# Altium schematic sheet ZTK7628P_convert_board_v1.0.SchDoc
size A4
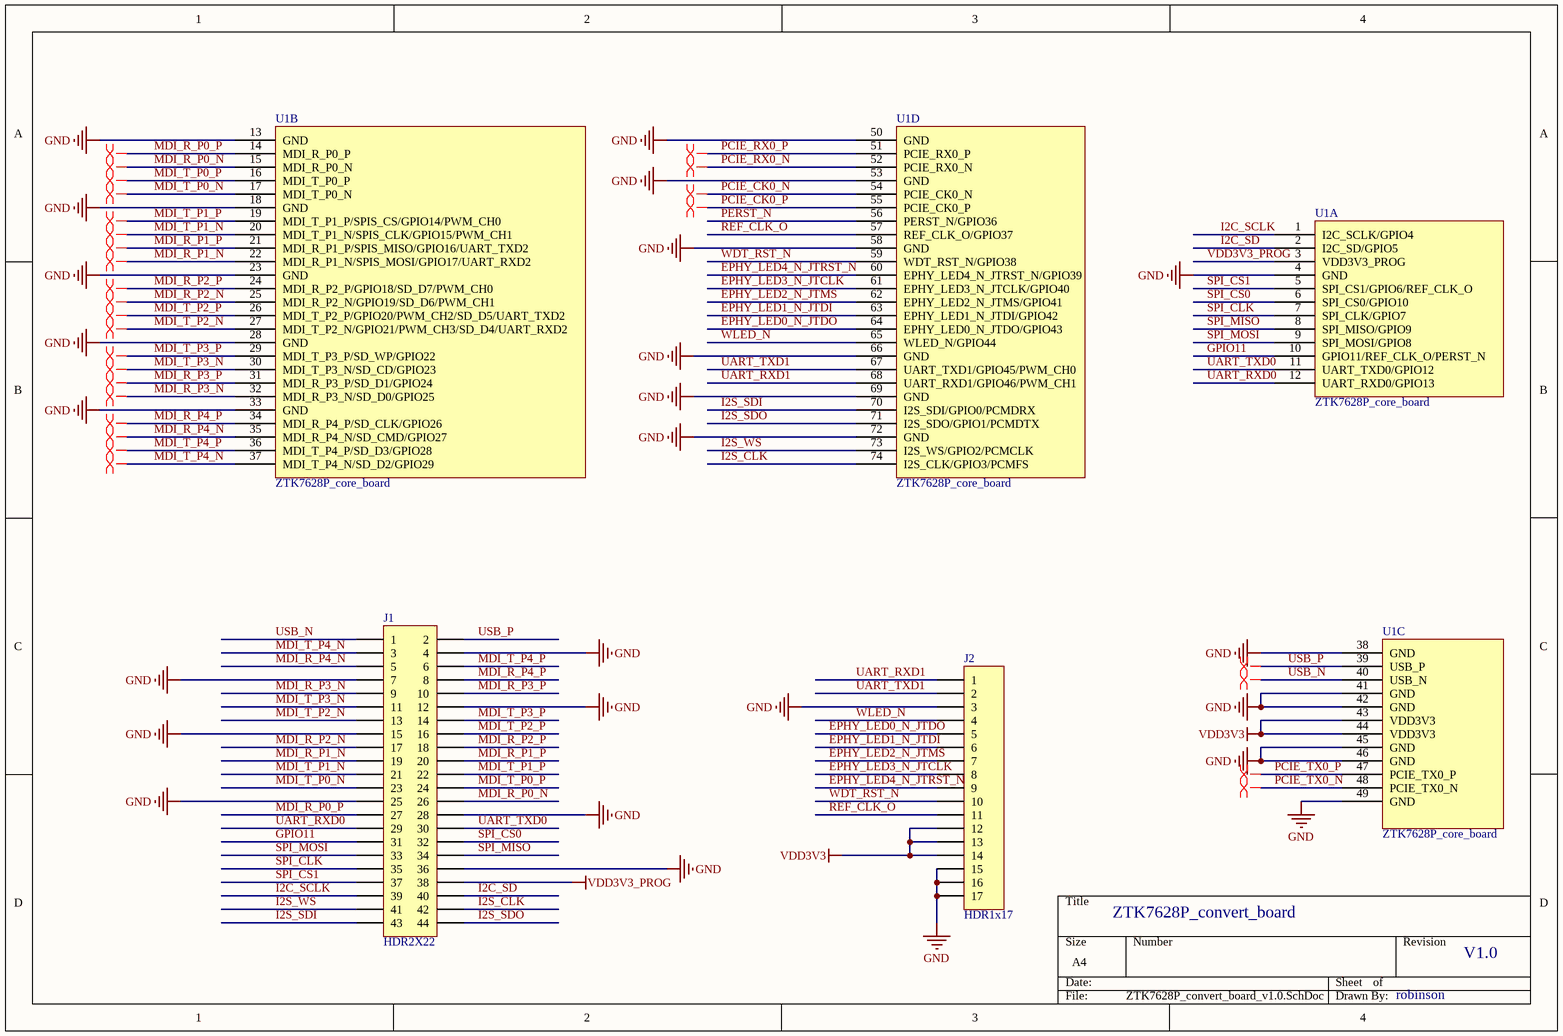
[diagram p0: ZTK7628P_convert_board_v1.0.SchDoc]

## Parts
J1  HDR2X22  [HDR2x22-P-2.0mm]
J2  HDR1x17  [HDR1x17-P-2.0mm]
U1  ZTK7628P_core_board  [ZTK7628P_core_board]  (parts A,B,C,D of 4)

## Nets
GND: J1.4 J1.7 J1.12 J1.15 J1.25 J1.28 J1.36 J2.3 J2.15 J2.16 J2.17 U1.4(GND) U1.13(GND) U1.18(GND) U1.23(GND) U1.28(GND) U1.33(GND) U1.38(GND) U1.41(GND) U1.42(GND) U1.45(GND) U1.46(GND) U1.49(GND) U1.50(GND) U1.53(GND) U1.58(GND) U1.66(GND) U1.69(GND) U1.72(GND)
VDD3V3: J2.12 J2.13 J2.14 U1.43(VDD3V3) U1.44(VDD3V3)
VDD3V3_PROG: J1.38 U1.3(VDD3V3_PROG)
EPHY_LED0_N_JTDO: J2.5 U1.64(EPHY_LED0_N_JTDO/GPIO43)
EPHY_LED1_N_JTDI: J2.6 U1.63(EPHY_LED1_N_JTDI/GPIO42)
EPHY_LED2_N_JTMS: J2.7 U1.62(EPHY_LED2_N_JTMS/GPIO41)
EPHY_LED3_N_JTCLK: J2.8 U1.61(EPHY_LED3_N_JTCLK/GPIO40)
EPHY_LED4_N_JTRST_N: J2.9 U1.60(EPHY_LED4_N_JTRST_N/GPIO39)
GPIO11: J1.31 U1.10(GPIO11/REF_CLK_O/PERST_N)
I2C_SCLK: J1.39 U1.1(I2C_SCLK/GPIO4)
I2C_SD: J1.40 U1.2(I2C_SD/GPIO5)
I2S_CLK: J1.42 U1.74(I2S_CLK/GPIO3/PCMFS)
I2S_SDI: J1.43 U1.70(I2S_SDI/GPIO0/PCMDRX)
I2S_SDO: J1.44 U1.71(I2S_SDO/GPIO1/PCMDTX)
I2S_WS: J1.41 U1.73(I2S_WS/GPIO2/PCMCLK)
MDI_R_P0_N: J1.26 U1.15(MDI_R_P0_N)
MDI_R_P0_P: J1.27 U1.14(MDI_R_P0_P)
MDI_R_P1_N: J1.19 U1.22(MDI_R_P1_N/SPIS_MOSI/GPIO17/UART_RXD2)
MDI_R_P1_P: J1.20 U1.21(MDI_R_P1_P/SPIS_MISO/GPIO16/UART_TXD2)
MDI_R_P2_N: J1.17 U1.25(MDI_R_P2_N/GPIO19/SD_D6/PWM_CH1)
MDI_R_P2_P: J1.18 U1.24(MDI_R_P2_P/GPIO18/SD_D7/PWM_CH0)
MDI_R_P3_N: J1.9 U1.32(MDI_R_P3_N/SD_D0/GPIO25)
MDI_R_P3_P: J1.10 U1.31(MDI_R_P3_P/SD_D1/GPIO24)
MDI_R_P4_N: J1.5 U1.35(MDI_R_P4_N/SD_CMD/GPIO27)
MDI_R_P4_P: J1.8 U1.34(MDI_R_P4_P/SD_CLK/GPIO26)
MDI_T_P0_N: J1.23 U1.17(MDI_T_P0_N)
MDI_T_P0_P: J1.24 U1.16(MDI_T_P0_P)
MDI_T_P1_N: J1.21 U1.20(MDI_T_P1_N/SPIS_CLK/GPIO15/PWM_CH1)
MDI_T_P1_P: J1.22 U1.19(MDI_T_P1_P/SPIS_CS/GPIO14/PWM_CH0)
MDI_T_P2_N: J1.13 U1.27(MDI_T_P2_N/GPIO21/PWM_CH3/SD_D4/UART_RXD2)
MDI_T_P2_P: J1.16 U1.26(MDI_T_P2_P/GPIO20/PWM_CH2/SD_D5/UART_TXD2)
MDI_T_P3_N: J1.11 U1.30(MDI_T_P3_N/SD_CD/GPIO23)
MDI_T_P3_P: J1.14 U1.29(MDI_T_P3_P/SD_WP/GPIO22)
MDI_T_P4_N: J1.3 U1.37(MDI_T_P4_N/SD_D2/GPIO29)
MDI_T_P4_P: J1.6 U1.36(MDI_T_P4_P/SD_D3/GPIO28)
PCIE_CK0_N: U1.54(PCIE_CK0_N)
PCIE_CK0_P: U1.55(PCIE_CK0_P)
PCIE_RX0_N: U1.52(PCIE_RX0_N)
PCIE_RX0_P: U1.51(PCIE_RX0_P)
PCIE_TX0_N: U1.48(PCIE_TX0_N)
PCIE_TX0_P: U1.47(PCIE_TX0_P)
PERST_N: U1.56(PERST_N/GPIO36)
REF_CLK_O: J2.11 U1.57(REF_CLK_O/GPIO37)
SPI_CLK: J1.35 U1.7(SPI_CLK/GPIO7)
SPI_CS0: J1.32 U1.6(SPI_CS0/GPIO10)
SPI_CS1: J1.37 U1.5(SPI_CS1/GPIO6/REF_CLK_O)
SPI_MISO: J1.34 U1.8(SPI_MISO/GPIO9)
SPI_MOSI: J1.33 U1.9(SPI_MOSI/GPIO8)
UART_RXD0: J1.29 U1.12(UART_RXD0/GPIO13)
UART_RXD1: J2.1 U1.68(UART_RXD1/GPIO46/PWM_CH1)
UART_TXD0: J1.30 U1.11(UART_TXD0/GPIO12)
UART_TXD1: J2.2 U1.67(UART_TXD1/GPIO45/PWM_CH0)
USB_N: J1.1 U1.40(USB_N)
USB_P: J1.2 U1.39(USB_P)
WDT_RST_N: J2.10 U1.59(WDT_RST_N/GPIO38)
WLED_N: J2.4 U1.65(WLED_N/GPIO44)

## Layout directives
differential pair: MDI_R_P0_N, MDI_R_P0_P, MDI_R_P1_N, MDI_R_P1_P, MDI_R_P2_N, MDI_R_P2_P, MDI_R_P3_N, MDI_R_P3_P, MDI_R_P4_N, MDI_R_P4_P, MDI_T_P0_N, MDI_T_P0_P, MDI_T_P1_N, MDI_T_P1_P, MDI_T_P2_N, MDI_T_P2_P, MDI_T_P3_N, MDI_T_P3_P, MDI_T_P4_N, MDI_T_P4_P, PCIE_CK0_N, PCIE_CK0_P, PCIE_RX0_N, PCIE_RX0_P, PCIE_TX0_N, PCIE_TX0_P, USB_N, USB_P

## Notes on the sheet
- ZTK7628P_convert_board
- V1.0
- robinson